# EAGLE design ESP8266-breakout (EAGLE 6.1)
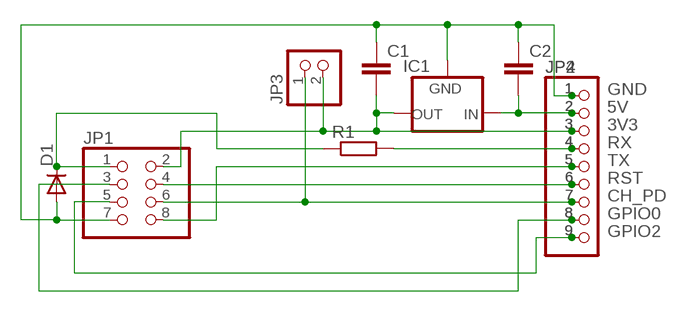
[diagram p0: schematic, sheet 1]

## Parts
C1  C-EU025-025X050  [C025-025X050]
C2  C-EU025-025X050  [C025-025X050]
D1  DIODE-D-5  [D-5]
IC1  V_REG_78XX-TO-220  [TO-220-ALT]
JP1  PINHD-2X4  [2X04]
JP2  PINHD-1X9  [1X09]
JP3  PINHD-1X2  [1X02]
JP4  PINHD-1X9  [1X09]
R1  R-EU_0204/7  [0204/7]

## Nets
3V3: C1.2 IC1.OUT JP1.2 JP2.3 JP3.2 JP4.3
5V: C2.2 IC1.IN JP2.2 JP4.2
CH_PD: JP1.6 JP2.7 JP3.1 JP4.7
GND: C1.1 C2.1 D1.A IC1.GND JP1.7 JP2.1 JP4.1
GPIO0: JP1.3 JP2.8 JP4.8
GPIO2: JP1.5 JP2.9 JP4.9
N$5: D1.C JP1.1 R1.1
RST: JP1.4 JP2.6 JP4.6
RX: JP2.4 JP4.4 R1.2
TX: JP1.8 JP2.5 JP4.5

## Library data of the parts
C1 C2 = rcl:C-EU: CAPACITOR, European symbol
D1 = diode:DIODE-: DIODE
IC1 = SparkFun-PowerIC:V_REG_78XX: Voltage Regulator Standard 7805 5V regulator. IGO (Input Ground Output). Spark Fun Electronics SKU : COM-00107
JP1 = pinhead:PINHD-2X4: PIN HEADER
JP2 JP4 = pinhead:PINHD-1X9: PIN HEADER
JP3 = pinhead:PINHD-1X2: PIN HEADER
R1 = rcl:R-EU_: RESISTOR, European symbol

## Board
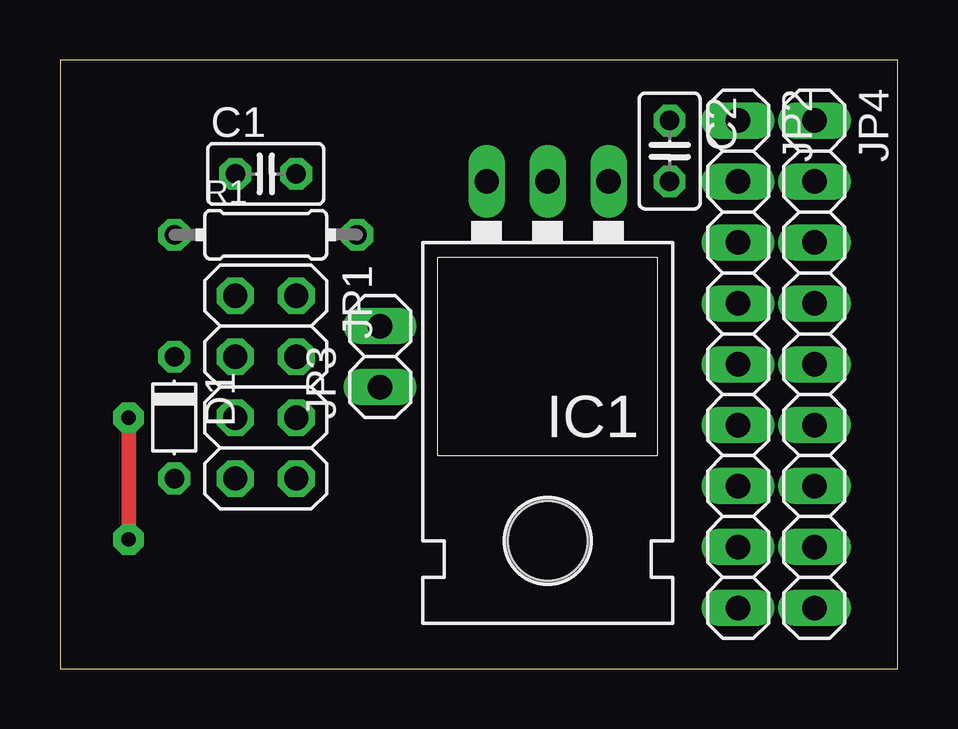
[diagram p1: board, top side]
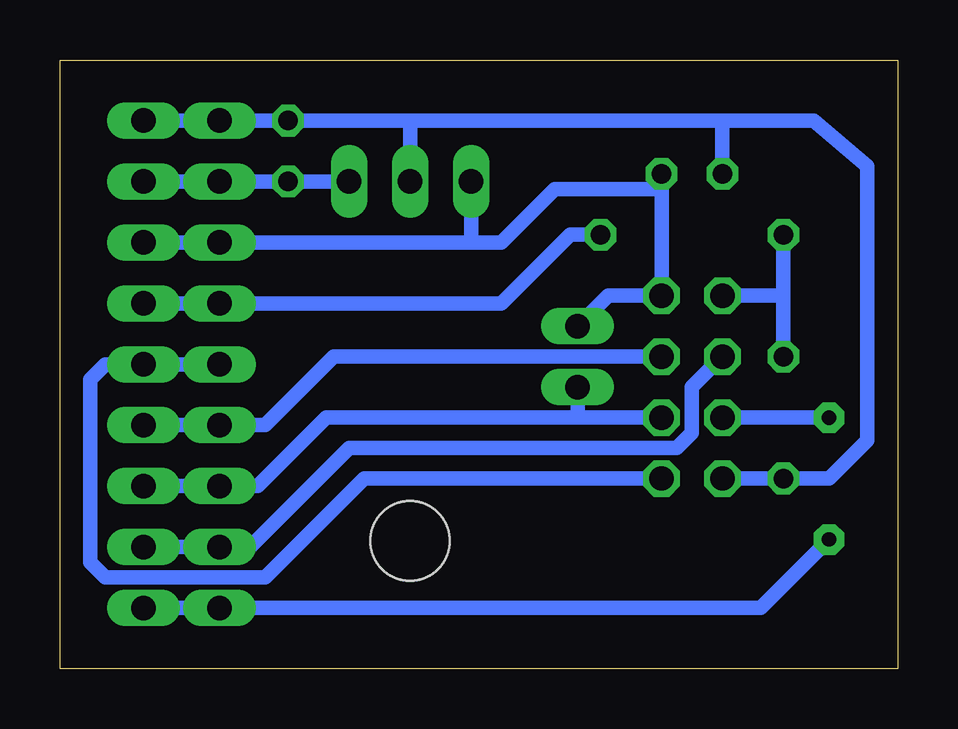
[diagram p2: board, bottom side, seen from below]

Size 34.91 x 25.39 mm. Coordinates in mm from the lower left corner, seen from the top.
Outline: 0,0 34.91,0 34.91,25.39 0,25.39 0,0
Copper layers (1*16): Top 0.035mm / dielectric 1.5mm / Bottom 0.035mm
Design rules: minimum track width 10mil, minimum drill 24mil, track to track 12mil, track to pad 12mil, pad to pad 12mil, via to via 12mil, smd to smd 10mil, copper to edge 12mil, drill to drill 12mil, minimum pad ring 10mil, minimum via ring 10mil, stop-mask expansion 4mil, vias tented up to drill 0mil, thermal gap 12mil

### Footprints (pad centres in the part's own frame; a part is rotated, then mirrored left to right if it is on the bottom)
C025-025X050 = drill 0.813 octagon: 1 -1.27,0; 2 1.27,0
D-5 = drill 0.813 octagon: A 2.54,0; C -2.54,0
TO-220-ALT = drill 1.016 long: GND 0,-3.81; IN -2.54,-3.81; OUT 2.54,-3.81 | hole 3.302: 0,11.176
2X04 = drill 1.016 octagon: 1 -3.81,-1.27; 2 -3.81,1.27; 3 -1.27,-1.27; 4 -1.27,1.27; 5 1.27,-1.27; 6 1.27,1.27; 7 3.81,-1.27; 8 3.81,1.27
1X09 = drill 1.016 long: 1 -10.16,0; 2 -7.62,0; 3 -5.08,0; 4 -2.54,0; 5 0,0; 6 2.54,0; 7 5.08,0; 8 7.62,0; 9 10.16,0
1X02 = drill 1.016 long: 1 -1.27,0; 2 1.27,0
0204/7 = drill 0.813 octagon: 1 -3.81,0; 2 3.81,0

### Placement (x,y rotation side)
C1  8.57,20.64 0 top
C2  25.4,21.59 270 top
D1  4.76,10.48 270 top
IC1  20.32,16.51 180 top
JP1  8.57,11.75 270 top
JP2  28.26,12.7 270 top
JP3  13.34,13.02 90 top
JP4  31.43,12.7 270 top
R1  8.57,18.1 0 top

### Tracks (layer width: path | path; a pad name or v marks a point on that pad's centre or on a via)
3V3
  Bottom 0.61: 9.84,20 JP1.2 12.06,15.56 JP3.2 | 9.84,20 C1.2 | 9.84,20 14.29,20 16.51,17.78 17.78,17.78 | JP4.3 JP2.3 17.78,17.78 | IC1.OUT 17.78,17.78
5V
  Bottom 0.61: IC1.IN C2.2 JP2.2 JP4.2
CH_PD
  Bottom 0.61: JP1.6 13.34,10.48 | JP3.1 13.34,10.48 | 13.34,10.48 23.81,10.48 26.67,7.62 JP2.7 JP4.7
GND
  Bottom 0.61: D1.A JP1.7 2.86,7.94 1.27,9.53 1.27,20.95 3.49,22.86 7.3,22.86 | 7.3,22.86 C1.1 | JP4.1 JP2.1 C2.1 20.32,22.86 | 20.32,22.86 7.3,22.86 | IC1.GND 20.32,22.86
GPIO0
  Bottom 0.61: JP1.3 8.57,11.75 8.57,9.84 9.21,9.21 22.86,9.21 26.99,5.08 JP2.8 JP4.8
GPIO2  (via drill 0.6 pad 1.27)
  Top 0.61: v2.86,10.48 v2.86,5.4
  Bottom 0.61: JP1.5 v2.86,10.48 | v2.86,5.4 5.71,2.54 JP2.9 JP4.9
N$5
  Bottom 0.61: 4.76,15.56 D1.C | JP1.1 4.76,15.56 | 4.76,15.56 R1.1
RST
  Bottom 0.61: JP1.4 23.5,13.02 26.35,10.16 JP2.6 JP4.6
RX
  Bottom 0.61: R1.2 13.65,18.1 16.51,15.24 JP2.4 JP4.4
TX
  Bottom 0.61: JP1.8 22.23,7.94 26.35,3.81 33.02,3.81 33.66,4.45 33.66,12.06 33.02,12.7 JP4.5 JP2.5